# EAGLE design master (EAGLE 9.5.2)
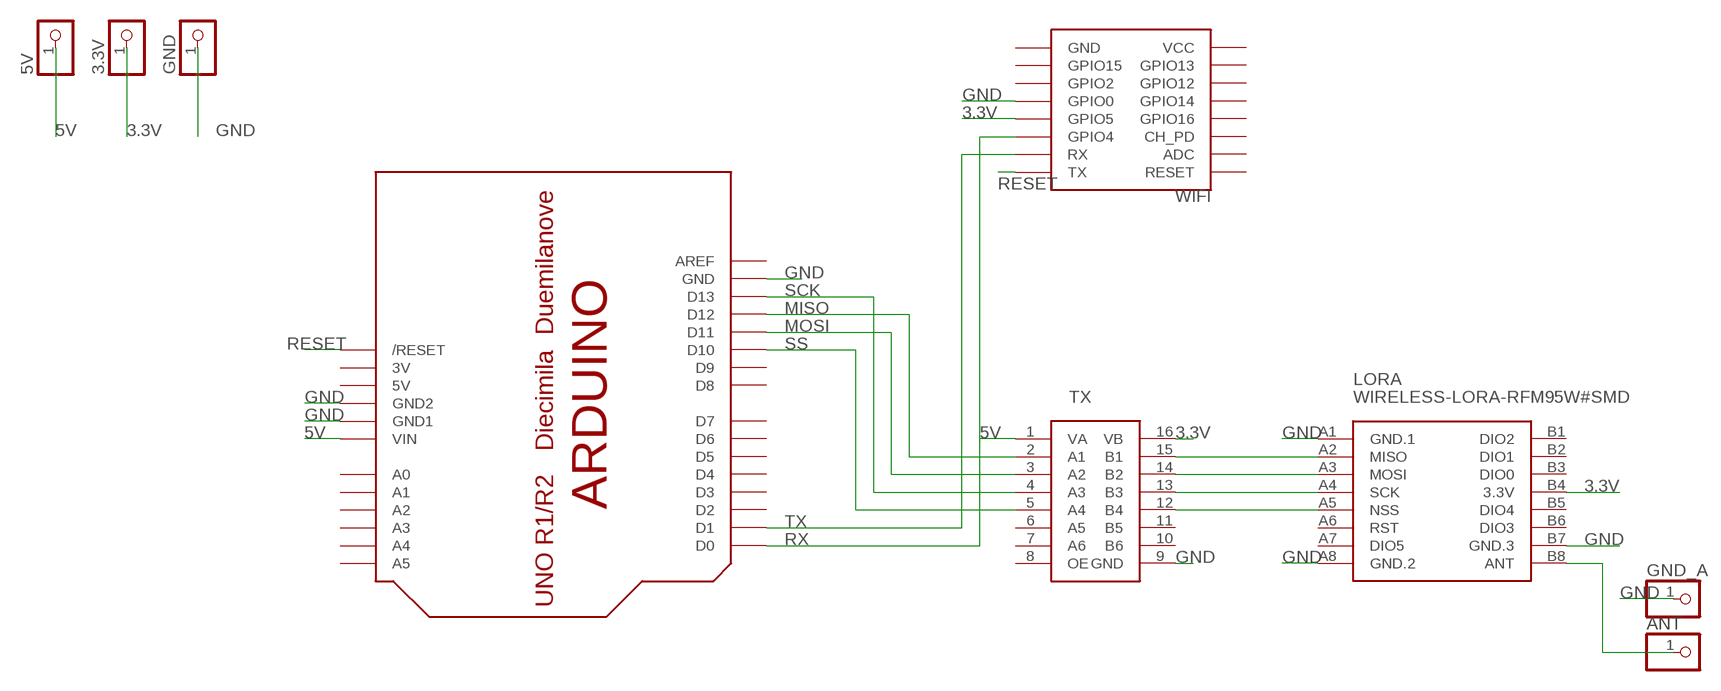
[diagram p0: schematic, sheet 1]

## Parts
3.3V  PINHD-1X1  [1X01]
5V  PINHD-1X1  [1X01]
ANT  PINHD-1X1  [1X01]
GND  PINHD-1X1  [1X01]
GND_A  PINHD-1X1  [1X01]
LORA  WIRELESS-LORA-RFM95W#SMD  [WIRELESS-LORA-RFM95W#SMD]
TX  TX50108E  [TX50108E]
U$1  ARDUINOUNO  [ARDUINO]
WIFI  ESP12  [ESP12]

## Nets
3.3V: 3.3V.1 LORA.B4(3.3V) TX.16(VB) WIFI.GPIO5
5V: 5V.1 TX.1(VA) U$1.VIN
GND: GND.1 GND_A.1 LORA.A1(GND.1) LORA.A8(GND.2) LORA.B7(GND.3) TX.9(GND) U$1.GND U$1.GND1 U$1.GND2 WIFI.GPIO0
MISO: TX.2(A1) U$1.D12
MOSI: TX.3(A2) U$1.D11
N$1: ANT.1 LORA.B8(ANT)
N$3: LORA.A2(MISO) TX.15(B1)
N$4: LORA.A3(MOSI) TX.14(B2)
N$5: LORA.A4(SCK) TX.13(B3)
N$6: LORA.A5(NSS) TX.12(B4)
RESET: U$1.RESET(/RESET) WIFI.TX
RX: U$1.D0 WIFI.GPIO4
SCK: TX.4(A3) U$1.D13
SS: TX.5(A4) U$1.D10
TX: U$1.D1 WIFI.RX
Unconnected: LORA.A6(RST) LORA.A7(DIO5) LORA.B1(DIO2) LORA.B2(DIO1) LORA.B3(DIO0) LORA.B5(DIO4) LORA.B6(DIO3) TX.6(A5) TX.7(A6) TX.8(OE) TX.10(B6) TX.11(B5) U$1.A0 U$1.A1 U$1.A2 U$1.A3 U$1.A4 U$1.A5 U$1.AREF U$1.D2 U$1.D3 U$1.D4 U$1.D5 U$1.D6 U$1.D7 U$1.D8 U$1.D9 WIFI.ADC WIFI.CH_PD WIFI.GND WIFI.GPIO2 WIFI.GPIO12 WIFI.GPIO13 WIFI.GPIO14 WIFI.GPIO15 WIFI.GPIO16 WIFI.RESET WIFI.VCC

## Power pins joined to a net without a drawn wire
3V: U$1.3V
5V: U$1.5V

## Library data of the parts
3.3V 5V ANT GND GND_A = pinhead:PINHD-1X1: PIN HEADER
LORA = dht22:WIRELESS-LORA-RFM95W: 868/915 MHz LoRa Radio Transceiver Module based on SX1276 chip Click here to find device on ebay.com <http://www.ebay.com/sch/RFM95W+transceiver>
TX = logicconv:TX50108E
U$1 = adafruit:ARDUINO: Arduino Diecimila/Duemilanove Make a shield with ease, this package has all the named pins as well as the two mounting drill holes and an outline of the USB and DC power connector. The outline is on the DIMENSION layer, so if your board house uses it they will cut the outline to match. http://www.ladyada.net/library/pcb/eaglelibrary.html
WIFI = esp8266modules:ESP12: ESP8266 Wifi module 12

## Board
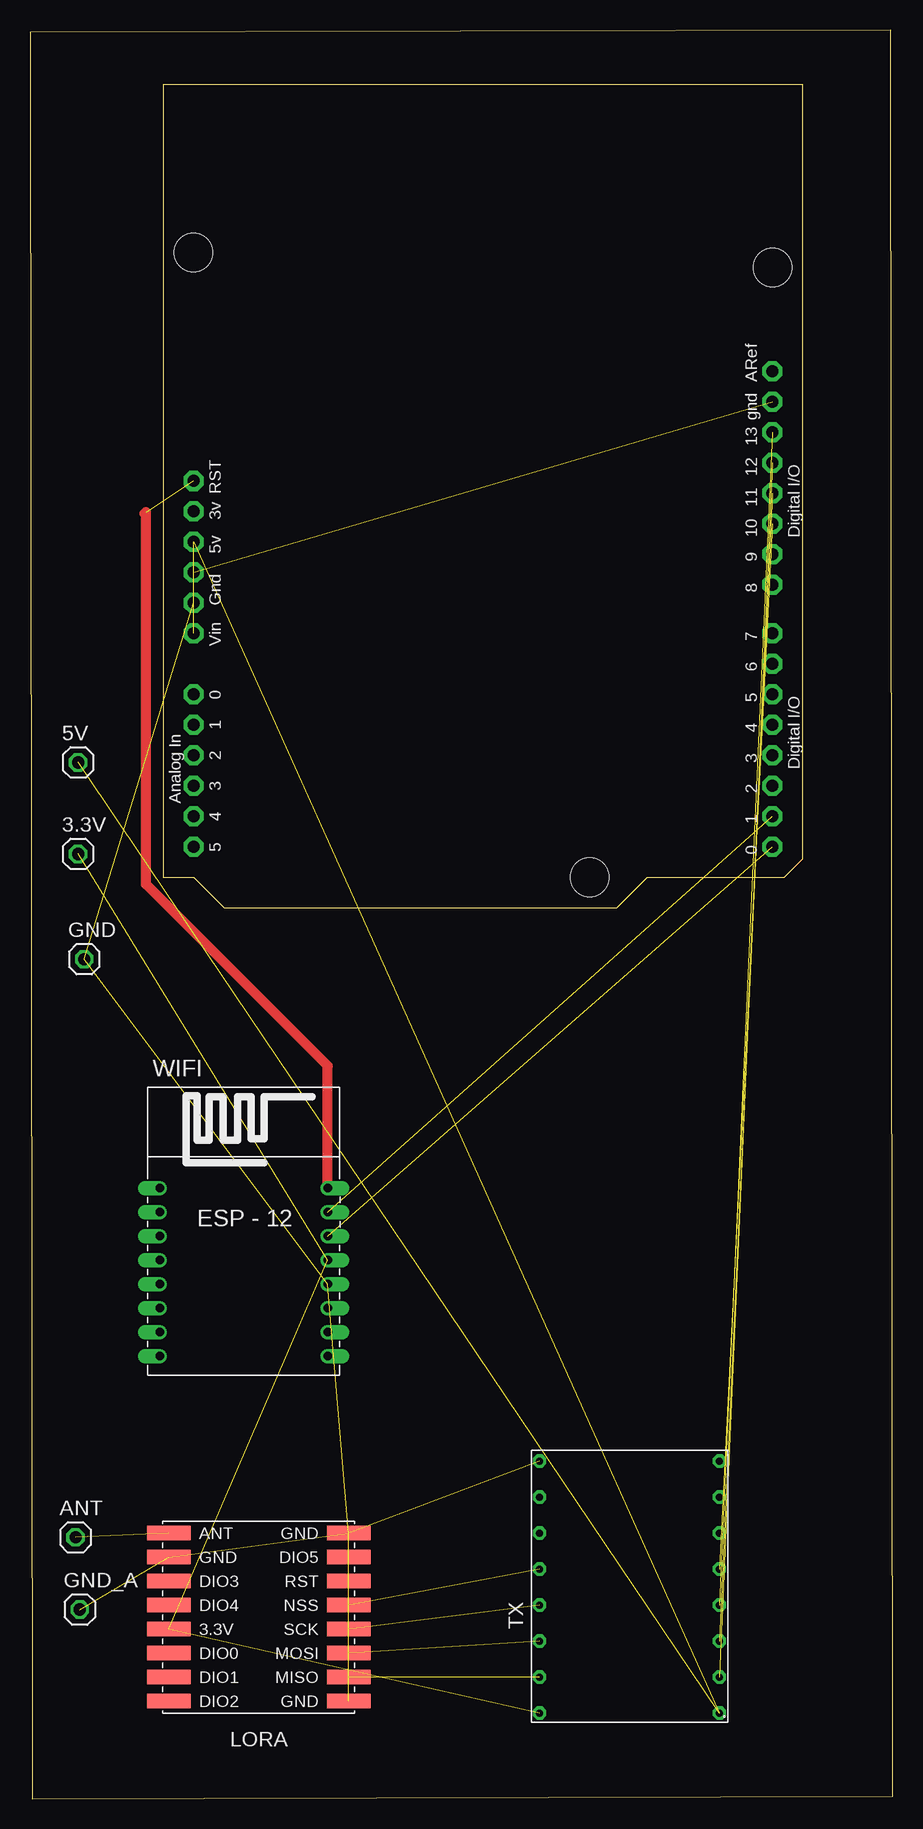
[diagram p1: board, top side]

Size 71.95 x 147.4 mm. Coordinates in mm from the lower left corner, seen from the top.
Outline: 0.2,0 71.95,0.2 71.75,147.4 0,147.2 0.2,0
Copper layers (1*16): Top 0.035mm / dielectric 1.5mm / Bottom 0.035mm
Design rules "default": minimum track width 6mil, minimum drill 0.35mm, track to track 6mil, track to pad 6mil, pad to pad 6mil, via to via 6mil, smd to smd 6mil, copper to edge 40mil, drill to drill 6mil, minimum pad ring 10mil, minimum via ring 8mil, stop-mask expansion 4mil, vias tented up to drill 0mil, thermal gap 10mil

### Footprints (pad centres in the part's own frame; a part is rotated, then mirrored left to right if it is on the bottom)
1X01 = drill 1.016 octagon: 1 0,0
WIRELESS-LORA-RFM95W#SMD = smd 3.6 x 1.2: A1 -7.5,7; A2 -7.5,5; A3 -7.5,3; A4 -7.5,1; A5 -7.5,-1; A6 -7.5,-3; A7 -7.5,-5; A8 -7.5,-7; B1 7.5,7; B2 7.5,5; B3 7.5,3; B4 7.5,1; B5 7.5,-1; B6 7.5,-3; B7 7.5,-5; B8 7.5,-7
TX50108E = drill 0.6 octagon: 1 -10.5,-7.5; 2 -7.5,-7.5; 3 -4.5,-7.5; 4 -1.5,-7.5; 5 1.5,-7.5; 6 4.5,-7.5; 7 7.5,-7.5; 8 10.5,-7.5; 9 10.5,7.5; 10 7.5,7.5; 11 4.5,7.5; 12 1.5,7.5; 13 -1.5,7.5; 14 -4.5,7.5; 15 -7.5,7.5; 16 -10.5,7.5
ARDUINO = drill 1 pad 1.676 octagon: 3V 35.56,2.54; 5V 38.1,2.54; A0 50.8,2.54; A1 53.34,2.54; A2 55.88,2.54; A3 58.42,2.54; A4 60.96,2.54; A5 63.5,2.54; AREF 23.876,50.8; D0 63.5,50.8; D1 60.96,50.8; D2 58.42,50.8; D3 55.88,50.8; D4 53.34,50.8; D5 50.8,50.8; D6 48.26,50.8; D7 45.72,50.8; D8 41.656,50.8; D9 39.116,50.8; D10 36.576,50.8; D11 34.036,50.8; D12 31.496,50.8; D13 28.956,50.8; GND 26.416,50.8; GND1 43.18,2.54; GND2 40.64,2.54; RESET 33.02,2.54; VIN 45.72,2.54 | hole 3.2: 15.24,50.8; 66.04,35.56; 13.97,2.54
ESP12 = drill 0.7 offset: ADC -7.1,3.8; CH_PD -7.1,1.8; GND 6.9,-8.2; GPIO0 6.9,-2.2; GPIO2 6.9,-4.2; GPIO4 6.9,1.8; GPIO5 6.9,-0.2; GPIO12 -7.1,-4.2; GPIO13 -7.1,-6.2; GPIO14 -7.1,-2.2; GPIO15 6.9,-6.2; GPIO16 -7.1,-0.2; RESET -7.1,5.8; RX 6.9,3.8; TX 6.9,5.8; VCC -7.1,-8.2

### Placement (x,y rotation side)
3.3V  4.01,78.74 0 top
5V  4.01,86.36 0 top
ANT  3.8,21.79 0 top
GND  4.52,69.97 0 top
GND_A  4.15,15.77 0 top
LORA  19.08,15.14 180 top
TX  49.98,17.64 90 top
U$1  11.1,142.84 270 top
WIFI  17.92,45.1 0 top

### Tracks (layer width: path | path; a pad name or v marks a point on that pad's centre or on a via)
3.3V  (3 unrouted)
5V  (3 unrouted)
GND  (9 unrouted)
MISO  (1 unrouted)
MOSI  (1 unrouted)
N$1  (1 unrouted)
N$3  (1 unrouted)
N$4  (1 unrouted)
N$5  (1 unrouted)
N$6  (1 unrouted)
RESET  (1 unrouted)
  Top 0.813: WIFI.TX 24.82,61.07 9.68,76.21 9.68,106.97 9.55,107.1 9.68,107.23 9.68,107.2
RX  (1 unrouted)
SCK  (1 unrouted)
SS  (1 unrouted)
TX  (1 unrouted)